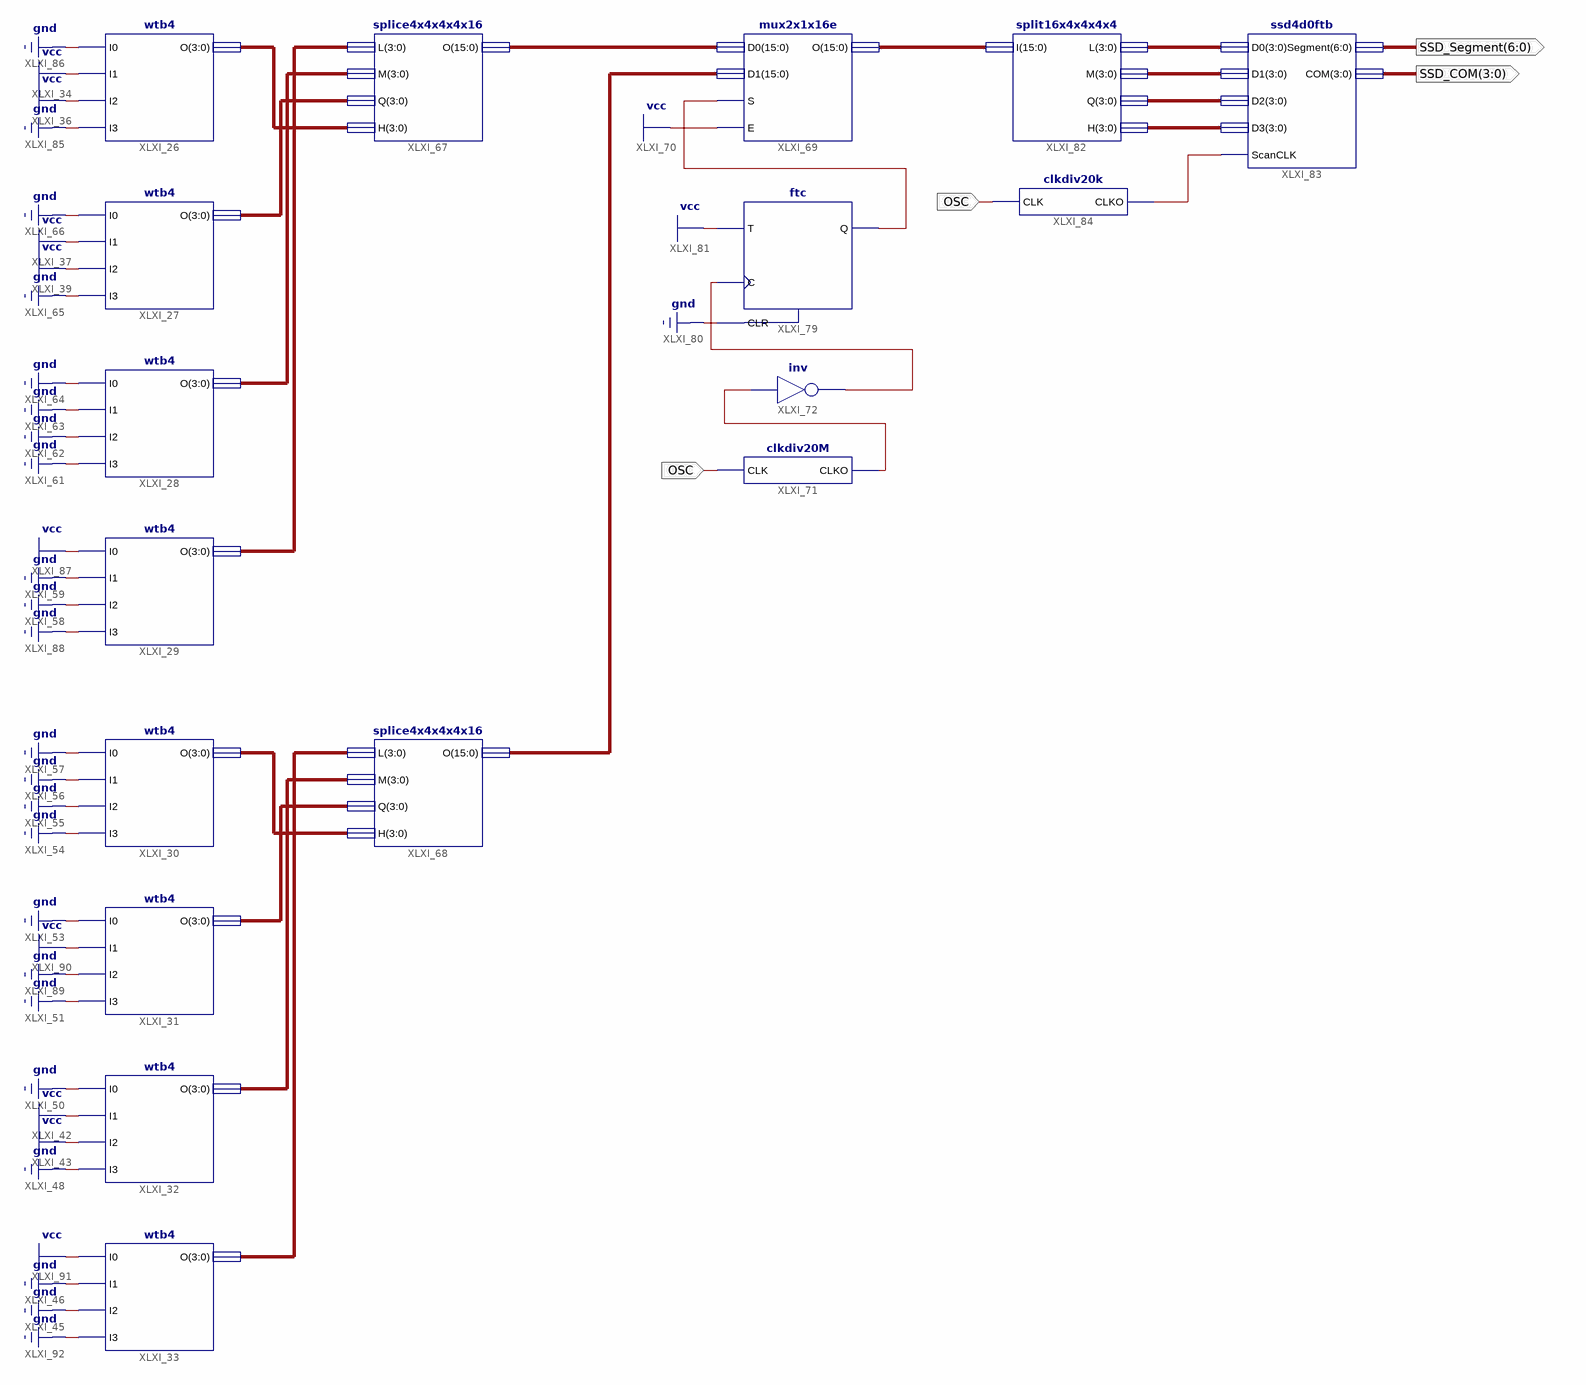
[diagram p0: schematic sheet 1]
// Xilinx ISE schematic main.sch (spartan6) as structural Verilog: 17 symbols, 3 ports
module main (
  input  OSC,
  output [3:0] SSD_COM,
  output [6:0] SSD_Segment
);

  wire XLXN_45, XLXN_50, XLXN_52, XLXN_60;
  wire [3:0] XLXN_55, XLXN_56, XLXN_57, XLXN_58, XLXN_67, XLXN_68, XLXN_71, XLXN_72, XLXN_73, XLXN_74,
       XLXN_75, XLXN_76;
  wire [15:0] XLXN_39, XLXN_40, XLXN_54;

  wtb4 XLXI_26 (.I0(1'b0), .I1(1'b1), .I2(1'b1), .I3(1'b0), .O(XLXN_72));
  wtb4 XLXI_27 (.I0(1'b0), .I1(1'b1), .I2(1'b1), .I3(1'b0), .O(XLXN_71));
  wtb4 XLXI_28 (.I0(1'b0), .I1(1'b0), .I2(1'b0), .I3(1'b0), .O(XLXN_68));
  wtb4 XLXI_29 (.I0(1'b1), .I1(1'b0), .I2(1'b0), .I3(1'b0), .O(XLXN_67));
  wtb4 XLXI_30 (.I0(1'b0), .I1(1'b0), .I2(1'b0), .I3(1'b0), .O(XLXN_76));
  wtb4 XLXI_31 (.I0(1'b0), .I1(1'b1), .I2(1'b0), .I3(1'b0), .O(XLXN_75));
  wtb4 XLXI_32 (.I0(1'b0), .I1(1'b1), .I2(1'b1), .I3(1'b0), .O(XLXN_74));
  wtb4 XLXI_33 (.I0(1'b1), .I1(1'b0), .I2(1'b0), .I3(1'b0), .O(XLXN_73));
  splice4x4x4x4x16 XLXI_67 (.H(XLXN_72), .L(XLXN_67), .M(XLXN_68), .O(XLXN_39), .Q(XLXN_71));
  splice4x4x4x4x16 XLXI_68 (.H(XLXN_76), .L(XLXN_73), .M(XLXN_74), .O(XLXN_40), .Q(XLXN_75));
  mux2x1x16e XLXI_69 (.D0(XLXN_39), .D1(XLXN_40), .E(1'b1), .O(XLXN_54), .S(XLXN_52));
  clkdiv20M XLXI_71 (.CLK(OSC), .CLKO(XLXN_45));
  not XLXI_72 (XLXN_50, XLXN_45);
  ftc XLXI_79 (.C(XLXN_50), .CLR(1'b0), .T(1'b1), .Q(XLXN_52));
  split16x4x4x4x4 XLXI_82 (.H(XLXN_58), .I(XLXN_54), .L(XLXN_55), .M(XLXN_56), .Q(XLXN_57));
  ssd4d0ftb XLXI_83 (
    .COM(SSD_COM), .D0(XLXN_55), .D1(XLXN_56), .D2(XLXN_57), .D3(XLXN_58), .ScanCLK(XLXN_60),
    .Segment(SSD_Segment));
  clkdiv20k XLXI_84 (.CLK(OSC), .CLKO(XLXN_60));
endmodule
